# EAGLE schematic AUX power board (EAGLE 7.5.0)
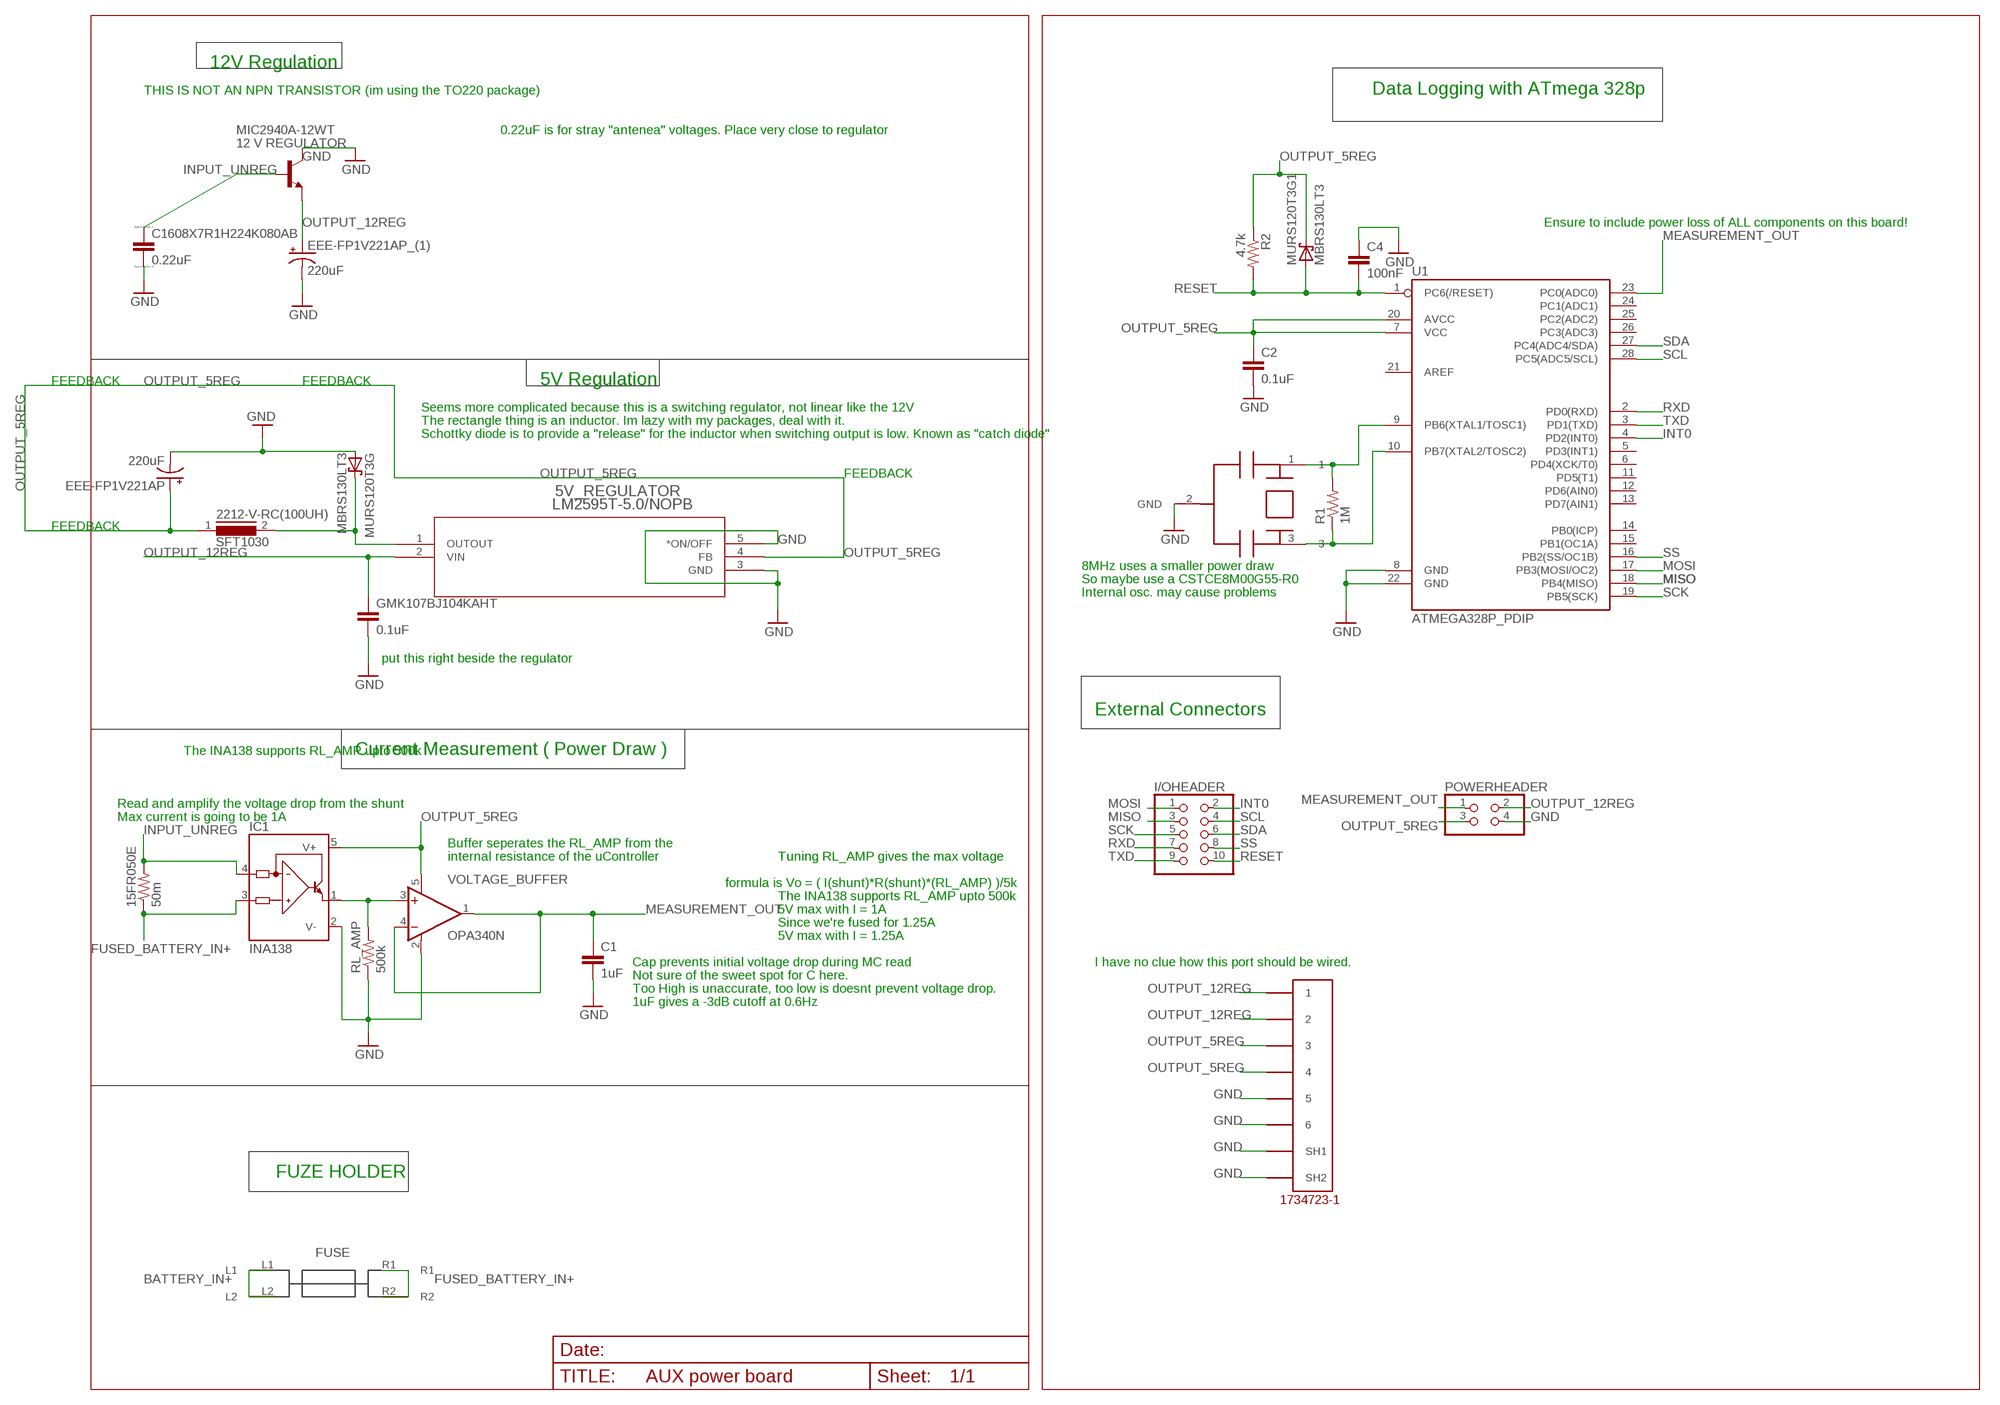
[diagram p0: schematic, sheet 1]

## Parts
5V_REGULATOR  LM2595T-5.0/NOPB  [T05D]
15FR050E  50m  R-US_0617/22  [0617/22]
2212-V-RC(100UH)  SFT1030  [SFT1030]
C1  1uF  C-EUC0603  [C0603]
C2  0.1uF  C-EUC0603  [C0603]
C4  100nF  C-EUC0603  [C0603]
C1608X7R1H224K080AB  0.22uF  CC0603  [C0603]
EEE-FP1V221AP  220uF  CPOL-US175TMP-0808  [175TMP-0808]
EEE-FP1V221AP_(1)  220uF  CPOL-US175TMP-0808  [175TMP-0808]
GMK107BJ104KAHT  0.1uF  C-EUC0603  [C0603]
I/OHEADER  PINHD-2X5  [2X05]
IC1  INA138  [SOT23-5]
MIC2940A-12WT  12 V REGULATOR  -NPN-TO220  [TO220]
MINIBLADE  3568  [3568]
MURS120T3G  MBRS130LT3  [SMB]
MURS120T3G1  MBRS130LT3  [SMB]
POWERHEADER  PINHD-2X2  [2X02]
R1  1M  R-US_R0603  [R0603]
R2  4.7k  R-US_R0603  [R0603]
RL_AMP  500k  R-US_R0603  [R0603]
U1  ATMEGA328P_PDIP  [DIL28-3]
U$1  CSTCE16M0V53-R0  [RESONATOR]
U$3  5555140-6  [1734723-1_RJ11]
VOLTAGE_BUFFER  OPA340N  [SOT23-5]

## Nets
BATTERY_IN+: MINIBLADE.L1 MINIBLADE.L2
FUSED_BATTERY_IN+: 15FR050E.1 IC1.3(IN+) MINIBLADE.R1 MINIBLADE.R2
GND: 5V_REGULATOR.3(GND) 5V_REGULATOR.5(*ON/OFF) C1.2 C2.2 C4.1 C1608X7R1H224K080AB.2 EEE-FP1V221AP.- EEE-FP1V221AP_(1).- GMK107BJ104KAHT.2 IC1.2(V-) MIC2940A-12WT.2(C) MURS120T3G.A POWERHEADER.4 RL_AMP.1 U1.8(GND) U1.22(GND) U$3.5 U$3.6 U$3.SH1 U$3.SH2 VOLTAGE_BUFFER.2(V-)
INPUT_UNREG: 15FR050E.2 C1608X7R1H224K080AB.1 IC1.4(IN-) MIC2940A-12WT.1(B)
INT0: I/OHEADER.2 U1.4(PD2(INT0))
MEASUREMENT_OUT: C1.1 POWERHEADER.1 U1.23(PC0(ADC0)) VOLTAGE_BUFFER.1(OUT) VOLTAGE_BUFFER.4(-IN)
MISO: I/OHEADER.3 U1.18(PB4(MISO))
MOSI: I/OHEADER.1 U1.17(PB3(MOSI/OC2))
N$1: 5V_REGULATOR.1(OUTOUT) 2212-V-RC(100UH).2 MURS120T3G.C
N$3: IC1.1(OUT) RL_AMP.2 VOLTAGE_BUFFER.3(+IN)
N$18: R1.2 U1.9(PB6(XTAL1/TOSC1))
N$19: R1.1 U1.10(PB7(XTAL2/TOSC2))
OUTPUT_5REG: 5V_REGULATOR.4(FB) 2212-V-RC(100UH).1 C2.1 EEE-FP1V221AP.+ IC1.5(V+) MURS120T3G1.C POWERHEADER.3 R2.1 U1.7(VCC) U1.20(AVCC) U$3.3 U$3.4 VOLTAGE_BUFFER.5(V+)
OUTPUT_12REG: 5V_REGULATOR.2(VIN) EEE-FP1V221AP_(1).+ GMK107BJ104KAHT.1 MIC2940A-12WT.3(E) POWERHEADER.2 U$3.1 U$3.2
RESET: C4.2 I/OHEADER.10 MURS120T3G1.A R2.2 U1.1(PC6(/RESET))
RXD: I/OHEADER.7 U1.2(PD0(RXD))
SCK: I/OHEADER.5 U1.19(PB5(SCK))
SCL: I/OHEADER.4 U1.28(PC5(ADC5/SCL))
SDA: I/OHEADER.6 U1.27(PC4(ADC4/SDA))
SS: I/OHEADER.8 U1.16(PB2(SS/OC1B))
TXD: I/OHEADER.9 U1.3(PD1(TXD))
Unconnected: U1.5(PD3(INT1)) U1.6(PD4(XCK/T0)) U1.11(PD5(T1)) U1.12(PD6(AIN0)) U1.13(PD7(AIN1)) U1.14(PB0(ICP)) U1.15(PB1(OC1A)) U1.21(AREF) U1.24(PC1(ADC1)) U1.25(PC2(ADC2)) U1.26(PC3(ADC3)) U$1.1 U$1.2(GND) U$1.3

## Notes on the sheet
- 12V Regulation
- THIS IS NOT AN NPN TRANSISTOR (im using the TO220 package) | Data Logging with ATmega 328p
- 0.22uF is for stray "antenea" voltages. Place very close to regulator
- Ensure to include power loss of ALL components on this board!
- FEEDBACK | FEEDBACK | 5V Regulation
- Seems more complicated because this is a switching regulator, not linear like the 12V
- The rectangle thing is an inductor. Im lazy with my packages, deal with it.
- Schottky diode is to provide a "release" for the inductor when switching output is low. Known as "catch diode"
- FEEDBACK
- FEEDBACK
- 8MHz uses a smaller power draw
- So maybe use a CSTCE8M00G55-R0
- Internal osc. may cause problems
- put this right beside the regulator
- External Connectors
- The INA138 supports RL_AMP upto 500k | Current Measurement ( Power Draw )
- Read and amplify the voltage drop from the shunt
- Max current is going to be 1A
- Buffer seperates the RL_AMP from the
- internal resistance of the uController | Tuning RL_AMP gives the max voltage
- formula is Vo = ( I(shunt)*R(shunt)*(RL_AMP) )/5k
- The INA138 supports RL_AMP upto 500k
- 5V max with I = 1A
- Since we're fused for 1.25A
- 5V max with I = 1.25A
- Cap prevents initial voltage drop during MC read | I have no clue how this port should be wired.
- Not sure of the sweet spot for C here.
- Too High is unaccurate, too low is doesnt prevent voltage drop.
- 1uF gives a -3dB cutoff at 0.6Hz
- FUZE HOLDER

## Library data of the parts
5V_REGULATOR = LM2595T-5:LM2595T-5.0/NOPB; COPYRIGHT: Copyright C 2015 Accelerated Designs. All rights reserved; MANUFACTURER_PART_NUMBER: LM2595T50; VENDOR: National Semiconductor
15FR050E R2 RL_AMP = resistor:R-US_: RESISTOR, American symbol
2212-V-RC(100UH) = inductors:SFT1030: INDUCTOR
C1 C2 = resistor:C-EU: CAPACITOR, European symbol
C4 GMK107BJ104KAHT = rcl:C-EU: CAPACITOR, European symbol
C1608X7R1H224K080AB = eagle-ltspice:C: CAPACITOR, European symbol; SPICEMODEL: NONE; SPICEPREFIX: C
EEE-FP1V221AP EEE-FP1V221AP_(1) = rcl:CPOL-US: POLARIZED CAPACITOR, American symbol
I/OHEADER = pinhead:PINHD-2X5: PIN HEADER
IC1 = burr-brown:INA138: High-Side Measurement Current Shunt Monitor; MF: TEXAS INSTRUMENTS; MPN: INA138NA/250; OC_FARNELL: 1564888; OC_NEWARK: 80K5906
MIC2940A-12WT = transistor:*-NPN-: NPN Transistror BF959 corrected 2008.03.06
MINIBLADE = fuse:3568
MURS120T3G MURS120T3G1 = diode:MBRS130LT3: Schottky Power Rectifier Source: http://www.onsemi.com/pub/Collateral/MBRS130LT3-D.PDF
POWERHEADER = pinhead:PINHD-2X2: PIN HEADER
R1 = rcl:R-US_: RESISTOR, American symbol
U1 = SparkFun-DigitalIC:ATMEGA328P_PDIP: uC used in the Arduino 32kb flash, 1k EEPROM, 2k SRAM This is the through-hole version of this chip.
U$1 = arduino_Uno_Rev3-02-TH:CSTCE16M0V53-R0
U$3 = 5555140-6 RJ11:5555140-6
VOLTAGE_BUFFER = burr-brown:OPA340: Rail-to-Rail Operational Amplifiers Single-Supply, MicroAmplifier(TM) Series; MPN: OPA340NA/3KG4; OC_FARNELL: 1234805; OC_NEWARK: 13M5177